# Altium schematic sheet main_2023-11-12.schdoc
size 419 x 296 mm
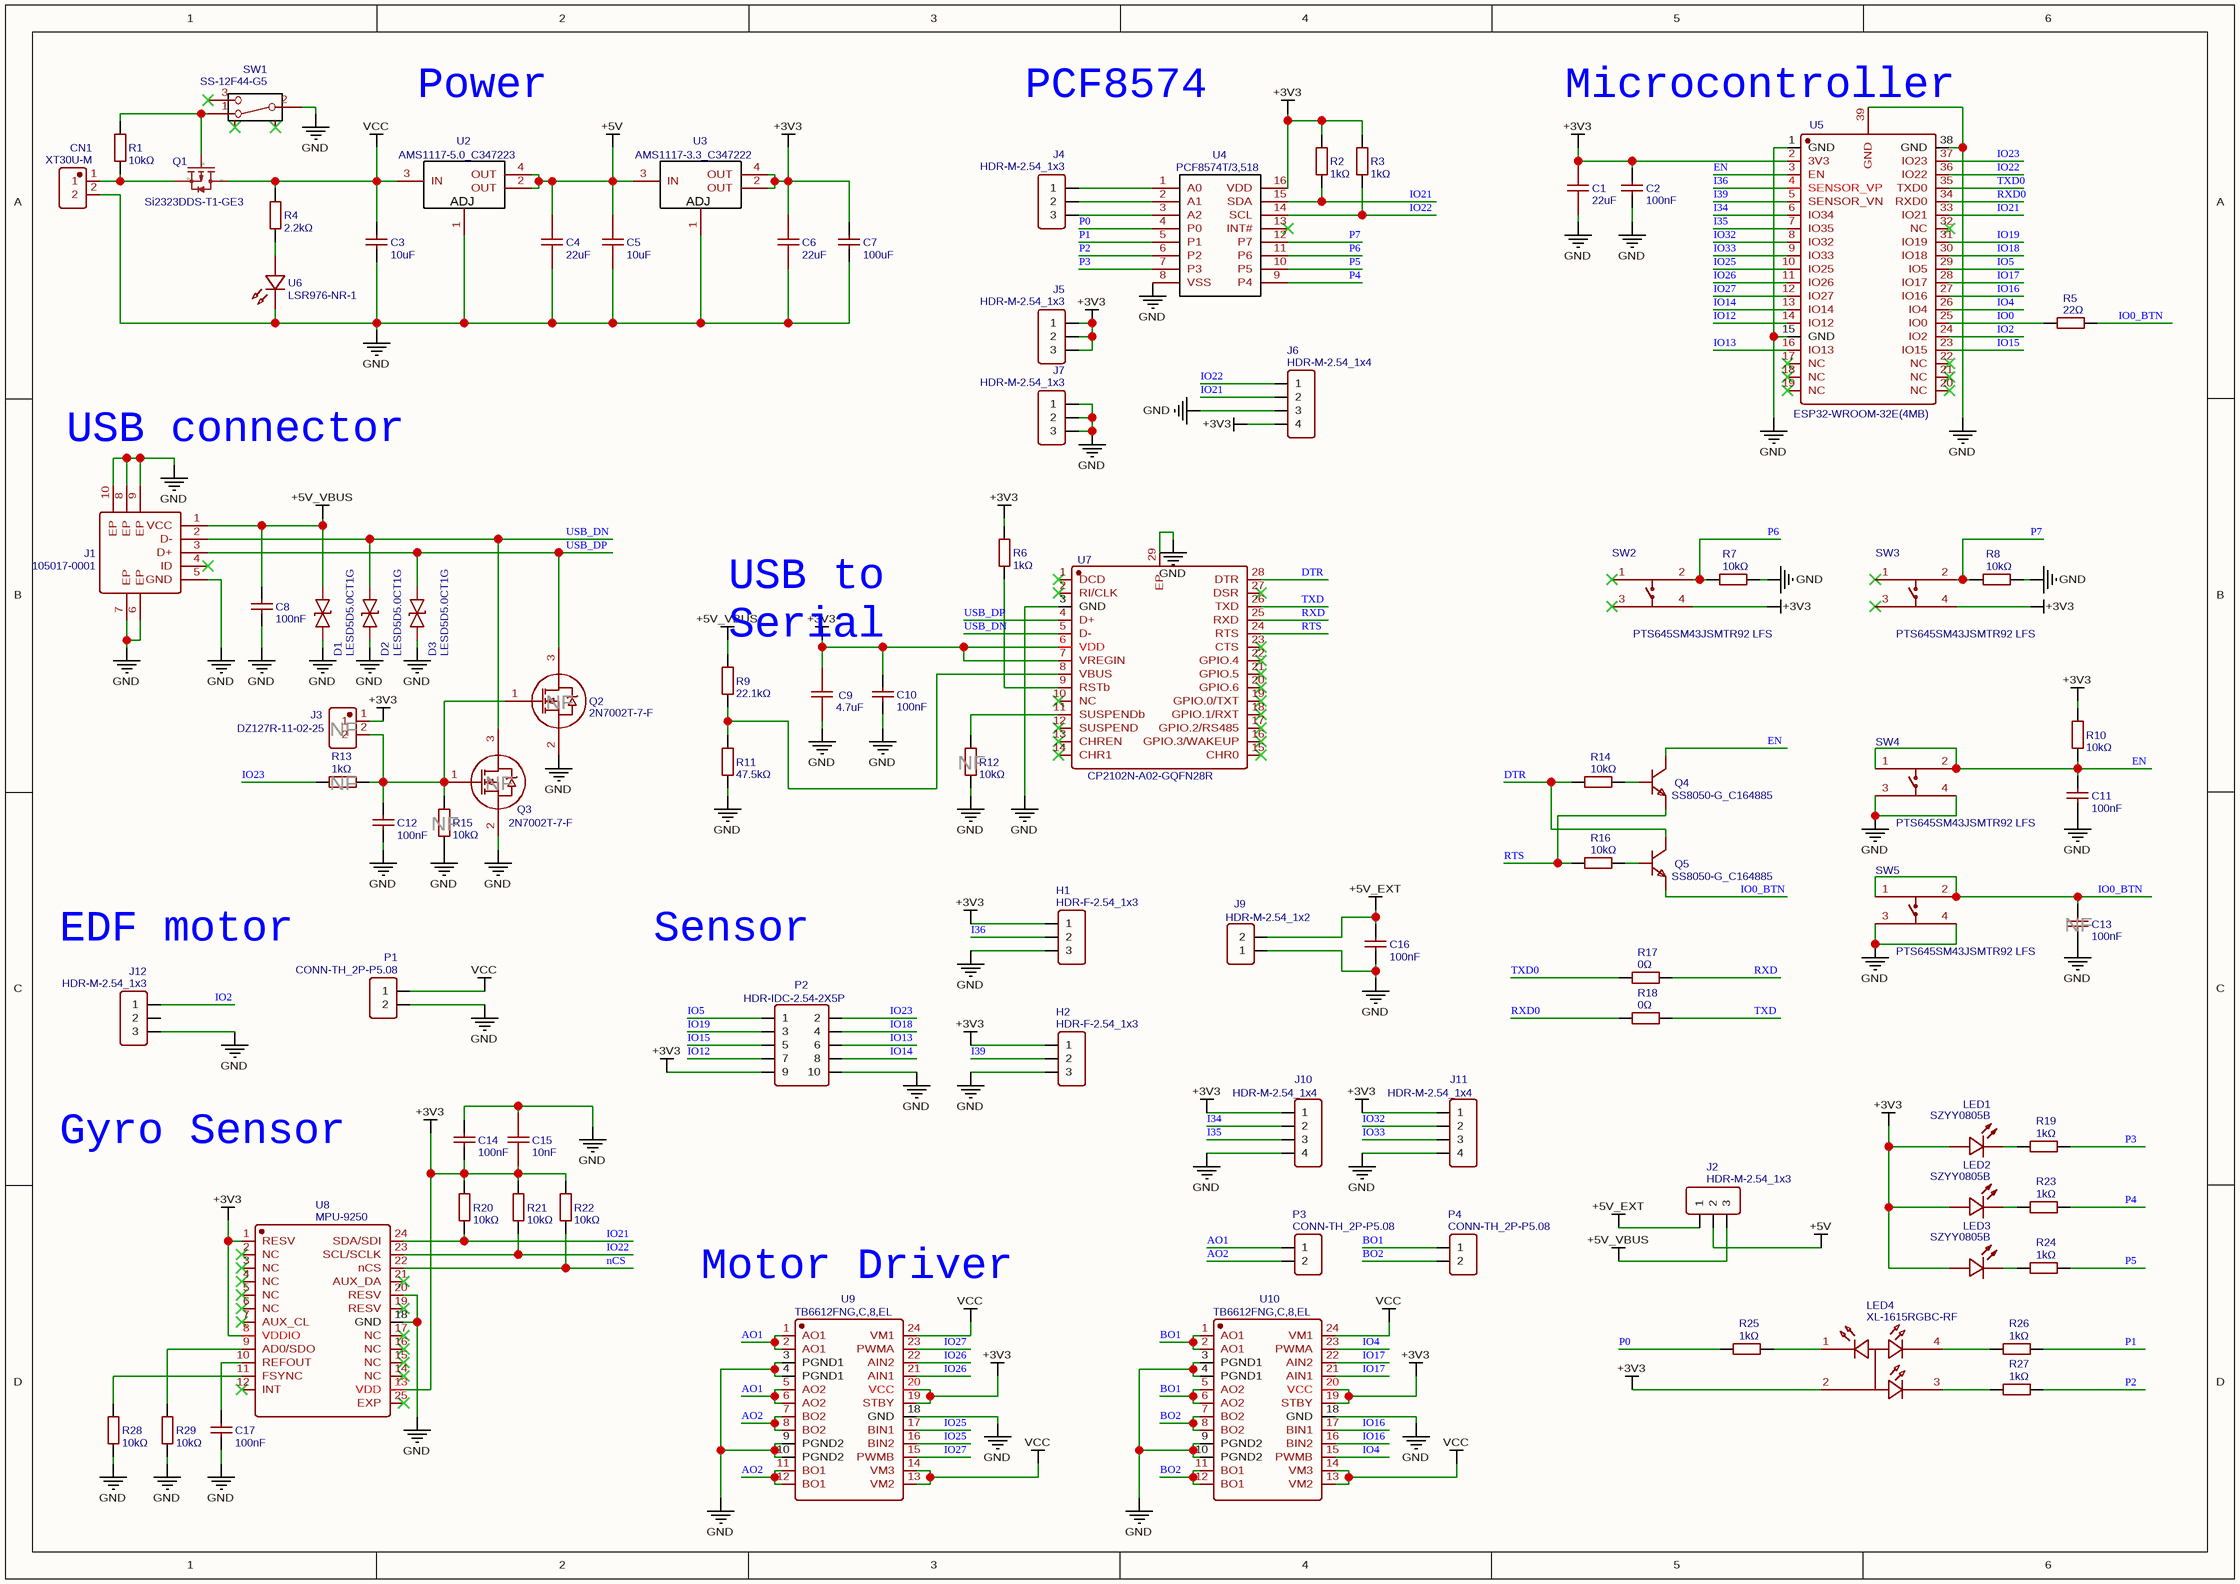
[diagram p0: main_2023-11-12.schdoc]

## Parts
C1  22uF  [C0805]
C2  100nF  [C0402]
C3  10uF  [C0805]
C4  22uF  [C0805]
C5  10uF  [C0402]
C6  22uF  [C0805]
C7  100uF  [C1206]
C8  100nF  [C0402]
C9  4.7uF  [C0402]
C10  100nF  [C0402]
C11  100nF  [C0402]
C12  100nF  [C0402]
C13  100nF  [C0402]
C14  100nF  [C0402]
C15  10nF  [C0402]
C16  100nF  [C0402]
C17  100nF  [C0402]
CN1  XT30U-M  [CONN-TH_XT30U-M]
D1  LESD5D5.0CT1G  [SOD-523_L1.2-W0.8-LS1.6-BI]
D2  LESD5D5.0CT1G  [SOD-523_L1.2-W0.8-LS1.6-BI]
D3  LESD5D5.0CT1G  [SOD-523_L1.2-W0.8-LS1.6-BI]
H1  HDR-F-2.54_1x3  [HDR-F-2.54_1X3]
H2  HDR-F-2.54_1x3  [HDR-F-2.54_1X3]
J1  105017-0001  [MICRO-USB-SMD_105017-0001]
J2  HDR-M-2.54_1x3  [HDR-M-2.54_1X3]
J3  DZ127R-11-02-25  [HDR-TH_2P-P1.27-V-M]
J4  HDR-M-2.54_1x3  [HDR-M-2.54_1X3]
J5  HDR-M-2.54_1x3  [HDR-M-2.54_1X3]
J6  HDR-M-2.54_1x4  [HDR-M-2.54_1X4]
J7  HDR-M-2.54_1x3  [HDR-M-2.54_1X3]
J9  HDR-M-2.54_1x2  [HDR-M-2.54_1X2]
J10  HDR-M-2.54_1x4  [HDR-M-2.54_1X4]
J11  HDR-M-2.54_1x4  [HDR-M-2.54_1X4]
J12  HDR-M-2.54_1x3  [HDR-M-2.54_1X3]
LED1  SZYY0805B  [LED0805-R-RD_BLUE]
LED2  SZYY0805B  [LED0805-R-RD_BLUE]
LED3  SZYY0805B  [LED0805-R-RD_BLUE]
LED4  XL-1615RGBC-RF  [LED-ARRAY-SMD_4P-L1.6-W1.5-BR_XL-1615RGBC-RF]
P1  CONN-TH_2P-P5.08  [CONN-TH_2P-P5.08]
P2  HDR-IDC-2.54-2X5P  [IDC-TH_10P-P2.54_C5665]
P3  CONN-TH_2P-P5.08  [CONN-TH_2P-P5.08]
P4  CONN-TH_2P-P5.08  [CONN-TH_2P-P5.08]
Q1  Si2323DDS-T1-GE3  [SOT-23-3_L2.9-W1.3-P1.90-LS2.4-BR]
Q2  2N7002T-7-F  [SOT-523-3_L1.6-W0.8-P1.00-LS1.6-BR]
Q3  2N7002T-7-F  [SOT-523-3_L1.6-W0.8-P1.00-LS1.6-BR]
Q4  SS8050-G_C164885  [SOT-23-3_L2.9-W1.3-P1.90-LS2.4-BR]
Q5  SS8050-G_C164885  [SOT-23-3_L2.9-W1.3-P1.90-LS2.4-BR]
R1  10kΩ  [R0805]
R2  1kΩ  [R0402]
R3  1kΩ  [R0402]
R4  2.2kΩ  [R0603]
R5  22Ω  [R0402]
R6  1kΩ  [R0402]
R7  10kΩ  [R0402]
R8  10kΩ  [R0402]
R9  22.1kΩ  [R0402]
R10  10kΩ  [R0402]
R11  47.5kΩ  [R0402]
R12  10kΩ  [R0402]
R13  1kΩ  [R0402]
R14  10kΩ  [R0402]
R15  10kΩ  [R0402]
R16  10kΩ  [R0402]
R17  0Ω  [R0402]
R18  0Ω  [R0402]
R19  1kΩ  [R0402]
R20  10kΩ  [R0402]
R21  10kΩ  [R0402]
R22  10kΩ  [R0402]
R23  1kΩ  [R0402]
R24  1kΩ  [R0402]
R25  1kΩ  [R0402]
R26  1kΩ  [R0402]
R27  1kΩ  [R0402]
R28  10kΩ  [R0402]
R29  10kΩ  [R0402]
SW1  SS-12F44-G5  [SW-TH_SS-12F44-G5]
SW2  PTS645SM43JSMTR92 LFS  [KEY-SMD_4P-L6.0-W6.0-P4.50-LS6.6]
SW3  PTS645SM43JSMTR92 LFS  [KEY-SMD_4P-L6.0-W6.0-P4.50-LS6.6]
SW4  PTS645SM43JSMTR92 LFS  [KEY-SMD_4P-L6.0-W6.0-P4.50-LS6.6]
SW5  PTS645SM43JSMTR92 LFS  [KEY-SMD_4P-L6.0-W6.0-P4.50-LS6.6]
U2  AMS1117-5.0_C347223  [SOT-223_L6.7-W3.5-P2.30-BR]
U3  AMS1117-3.3_C347222  [SOT-223_L6.7-W3.5-P2.30-BR]
U4  PCF8574T/3,518  [SOIC-16_L10.3-W7.5-P1.27-LS10.3-BL]
U5  ESP32-WROOM-32E(4MB)  [WIFI-SMD_ESP32-WROOM-32E]
U6  LSR976-NR-1  [LED0805-RD_RED]
U7  CP2102N-A02-GQFN28R  [QFN-28_L5.0-W5.0-P0.50-TL-EP3.3]
U8  MPU-9250  [QFN-24_L3.0-W3.0-P0.40-BL-EP]
U9  TB6612FNG,C,8,EL  [SSOP-24_L8.3-W5.6-P0.65-LS7.6-BL]
U10  TB6612FNG,C,8,EL  [SSOP-24_L8.3-W5.6-P0.65-LS7.6-BL]

## Nets
+3V3: C1.1 C2.1 C6.1 C7.1 C9.2 C10.1 C14.1 C15.1 H1.1 H2.1 J3.1 J5.1 J5.2 J5.3 J6.4 J10.1 J11.1 LED1.1(+) LED2.1(+) LED3.1(+) LED4.2(COM+) P2.9 R2.1 R3.1 R6.1 R10.1 R20.1 R21.1 R22.1 SW2.4 SW3.4 U3.2(OUT) U3.4(OUT) U4.16(VDD) U5.2(3V3) U7.6(VDD) U7.7(VREGIN) U8.1(RESV) U8.8(VDDIO) U8.13(VDD) U9.19(STBY) U9.20(VCC) U10.19(STBY) U10.20(VCC)
+5V: C4.1 C5.1 J2.2 U2.2(OUT) U2.4(OUT) U3.3(IN)
+5V_EXT: C16.2 J2.1 J9.2
+5V_VBUS: C8.1 D1.1 J1.1(VCC) J2.3 R9.1
GND: C1.2 C2.2 C3.2 C4.2 C5.2 C6.2 C7.2 C8.2 C9.1 C10.2 C11.2 C12.2 C13.2 C14.2 C15.2 C16.1 C17.2 CN1.2 D1.2 D2.2 D3.2 H1.3 H2.3 J1.5(GND) J1.6(EP) J1.7(EP) J1.8(EP) J1.9(EP) J1.10(EP) J6.3 J7.1 J7.2 J7.3 J9.1 J10.4 J11.4 J12.3 P1.2 P2.10 Q2.2(S) Q3.2(S) R7.2 R8.2 R11.2 R12.2 R15.2 R28.2 R29.2 SW1.2 SW4.3 SW4.4 SW5.3 SW5.4 U2.1(ADJ) U3.1(ADJ) U4.8(VSS) U5.1(GND) U5.15(GND) U5.38(GND) U5.39(GND) U6.1(K) U7.3(GND) U7.29(EP) U8.18(GND) U8.20(RESV) U9.3(PGND1) U9.4(PGND1) U9.9(PGND2) U9.10(PGND2) U9.18(GND) U10.3(PGND1) U10.4(PGND1) U10.9(PGND2) U10.10(PGND2) U10.18(GND)
VCC: C3.1 P1.1 Q1.3(D) R4.1 U2.3(IN) U9.13(VM2) U9.14(VM3) U9.24(VM1) U10.13(VM2) U10.14(VM3) U10.24(VM1)
AO1: P3.1 U9.1(AO1) U9.2(AO1) U9.5(AO2) U9.6(AO2)
AO2: P3.2 U9.7(BO2) U9.8(BO2) U9.11(BO1) U9.12(BO1)
BO1: P4.1 U10.1(AO1) U10.2(AO1) U10.5(AO2) U10.6(AO2)
BO2: P4.2 U10.7(BO2) U10.8(BO2) U10.11(BO1) U10.12(BO1)
DTR: Q5.3(C) R14.1 U7.28(DTR)
EN: C11.1 Q4.3(C) R10.2 SW4.1 SW4.2 U5.3(EN)
I34: J10.2 U5.6(IO34)
I35: J10.3 U5.7(IO35)
I36: H1.2 U5.4(SENSOR_VP)
I39: H2.2 U5.5(SENSOR_VN)
IO0: R5.1 U5.25(IO0)
IO0_BTN: C13.1 Q5.2(E) R5.2 SW5.1 SW5.2
IO2: J12.1 U5.24(IO2)
IO4: U5.26(IO4) U10.15(PWMB) U10.23(PWMA)
IO5: P2.1 U5.29(IO5)
IO12: P2.7 U5.14(IO12)
IO13: P2.6 U5.16(IO13)
IO14: P2.8 U5.13(IO14)
IO15: P2.5 U5.23(IO15)
IO16: U5.27(IO16) U10.16(BIN2) U10.17(BIN1)
IO17: U5.28(IO17) U10.21(AIN1) U10.22(AIN2)
IO18: P2.4 U5.30(IO18)
IO19: P2.3 U5.31(IO19)
IO21: J6.2 R2.2 R20.2 U4.15(SDA) U5.33(IO21) U8.24(SDA/SDI)
IO22: J6.1 R3.2 R21.2 U4.14(SCL) U5.36(IO22) U8.23(SCL/SCLK)
IO23: P2.2 R13.1 U5.37(IO23)
IO25: U5.10(IO25) U9.16(BIN2) U9.17(BIN1)
IO26: U5.11(IO26) U9.21(AIN1) U9.22(AIN2)
IO27: U5.12(IO27) U9.15(PWMB) U9.23(PWMA)
IO32: J11.2 U5.8(IO32)
IO33: J11.3 U5.9(IO33)
nCS: R22.2 U8.22(nCS)
P0: R25.1 U4.4(P0)
P1: R26.2 U4.5(P1)
P2: R27.2 U4.6(P2)
P3: R19.2 U4.7(P3)
P4: R23.2 U4.9(P4)
P5: R24.2 U4.10(P5)
P6: R7.1 SW2.2 U4.11(P6)
P7: R8.1 SW3.2 U4.12(P7)
RTS: Q4.2(E) R16.1 U7.24(RTS)
RXD: R17.2 U7.25(RXD)
RXD0: R18.1 U5.34(RXD0)
TXD: R18.2 U7.26(TXD)
TXD0: R17.1 U5.35(TXD0)
USB_DN: D2.1 J1.2(D-) Q3.3(D) U7.5(D-)
USB_DP: D3.1 J1.3(D+) Q2.3(D) U7.4(D+)
NetC12_1: C12.1 J3.2 Q2.1(G) Q3.1(G) R13.2 R15.1
NetC17_1: C17.1 U8.10(REFOUT)
NetCN1_1: CN1.1 Q1.2(S) R1.2
NetJ4_1: J4.1 U4.1(A0)
NetJ4_2: J4.2 U4.2(A1)
NetJ4_3: J4.3 U4.3(A2)
NetLED1_2: LED1.2(-) R19.1
NetLED2_2: LED2.2(-) R23.1
NetLED3_2: LED3.2(-) R24.1
NetLED4_1: LED4.1(R-) R25.2
NetLED4_3: LED4.3(B-) R27.1
NetLED4_4: LED4.4(G-) R26.1
NetQ1_1: Q1.1(G) R1.1 SW1.1
NetQ4_1: Q4.1(B) R14.2
NetQ5_1: Q5.1(B) R16.2
NetR4_2: R4.2 U6.2(A)
NetR6_2: R6.2 U7.9(RSTb)
NetR9_2: R9.2 R11.1 U7.8(VBUS)
NetR12_1: R12.1 U7.11(SUSPENDb)
NetR28_1: R28.1 U8.11(FSYNC)
NetR29_1: R29.1 U8.9(AD0/SDO)

Not connected (* = marked no-connect by the designer): J1 4(ID)*; J12 2; SW1 3* 4* 5*; SW2 1* 3*; SW3 1* 3*; U4 13(INT#)*; U5 17(NC)* 18(NC)* 19(NC)* 20(NC)* 21(NC)* 22(NC)* 32(NC)*; U7 1(DCD)* 2(RI/CLK)* 10(NC)* 12(SUSPEND)* 13(CHREN)* 14(CHR1)* 15(CHR0)* 16(GPIO.3/WAKEUP)* 17(GPIO.2/RS485)* 18(GPIO.1/RXT)* 19(GPIO.0/TXT)* 20(GPIO.6)* 21(GPIO.5)* 22(GPIO.4)* 23(CTS)* 27(DSR)*; U8 2(NC)* 3(NC)* 4(NC)* 5(NC)* 6(NC)* 7(AUX_CL)* 12(INT)* 14(NC)* 15(NC)* 16(NC)* 17(NC)* 19(RESV)* 21(AUX_DA)* 25(EXP)*

## Notes on the sheet
- Power
- PCF8574
- (near U5) Microcontroller
- USB connector
- USB to
  Serial
- (near Q2) NF
- (near R13) NF
- (near J3) NF
- (near Q3) NF
- (near R12) NF
- (near R15) NF
- (near C13) NF
- (near J12) EDF motor
- Sensor
- Gyro Sensor
- (near U9) Motor Driver

## Library data of the parts
C1 = 22uF: Manufacturer: SAMSUNG(三星); Manufacturer Part: CL21A226MAYNNNE; nameAlias: Value; Contributor: LCSC; Supplier: LCSC; Supplier Part: C602037; JLCPCB Part Class: Extended Part; link: https://lcsc.com/eda_search?q=C602037&%26type=1&ref=editor; spicePre: C; spiceSymbolName: CL21A226MAYNNNE
C2 C8 C10-C14 C16 C17 = 100nF: Manufacturer Part: CL05B104KO5NNNC; Manufacturer: SAMSUNG(三星); nameAlias: Value; Supplier: LCSC; Supplier Part: C1525; JLCPCB Part Class: Basic Part; link: https://lcsc.com/eda_search?q=C1525&%26type=1&ref=editor; spicePre: C; spiceSymbolName: CL05B104KO5NNNC
C3 = 10uF: Manufacturer Part: CL21A106KOQNNNE; Manufacturer: SAMSUNG(三星); nameAlias: Value; Supplier: LCSC; Supplier Part: C1713; JLCPCB Part Class: Extended Part; link: https://lcsc.com/eda_search?q=C1713&%26type=1&ref=editor; spicePre: C; spiceSymbolName: CL21A106KOQNNNE
C4 C6 = 22uF: Manufacturer: SAMSUNG(三星); Manufacturer Part: CL21A226MAQNNNE; nameAlias: Value; Supplier: LCSC; Supplier Part: C45783; JLCPCB Part Class: Basic Part; link: https://lcsc.com/eda_search?q=C45783&%26type=1&ref=editor; spicePre: C; spiceSymbolName: CL21A226MAQNNNE
C5 = 10uF: Manufacturer: SAMSUNG(三星); Manufacturer Part: CL05A106MP5NUNC; nameAlias: Value; Contributor: LCSC; Supplier: LCSC; Supplier Part: C315248; JLCPCB Part Class: Extended Part; link: https://lcsc.com/eda_search?q=C315248&%26type=1&ref=editor; spicePre: C; spiceSymbolName: CL05A106MP5NUNC_C315248
C7 = 100uF: Manufacturer Part: CL31A107MQHNNNE; Manufacturer: SAMSUNG(三星); nameAlias: Value; Supplier: LCSC; Supplier Part: C15008; JLCPCB Part Class: Basic Part; link: https://lcsc.com/eda_search?q=C15008&%26type=1&ref=editor; spicePre: C; spiceSymbolName: CL31A107MQHNNNE
C9 = 4.7uF: Manufacturer: SAMSUNG(三星); Manufacturer Part: CL05A475KP5NRNC; nameAlias: Value; Contributor: LCSC; Supplier: LCSC; Supplier Part: C368809; JLCPCB Part Class: Extended Part; link: https://lcsc.com/eda_search?q=C368809&%26type=1&ref=editor; spicePre: C; spiceSymbolName: CL05A475KP5NRNC
C15 = 10nF: Manufacturer: SAMSUNG(三星); Manufacturer Part: CL05B103JO5NNNC; nameAlias: Value; Contributor: LCSC; Supplier: LCSC; Supplier Part: C400948; JLCPCB Part Class: Extended Part; link: https://lcsc.com/eda_search?q=C400948&%26type=1&ref=editor; spicePre: C; spiceSymbolName: CL05B103JO5NNNC
CN1 = XT30U-M: Manufacturer: AMASS(艾迈斯); Contributor: lcsc; Supplier: LCSC; Supplier Part: C99101; Manufacturer Part: XT30U-M; JLCPCB Part Class: Extended Part; link: https://lcsc.com/eda_search?q=C99101&%26type=1&ref=editor; spicePre: C; spiceSymbolName: XT30U-M
D1-D3 = LESD5D5.0CT1G: Manufacturer: LRC(乐山无线电); Contributor: LCSC; Supplier: LCSC; Supplier Part: C383211; Manufacturer Part: LESD5D5.0CT1G; JLCPCB Part Class: Extended Part; link: https://lcsc.com/eda_search?q=C383211&%26type=1&ref=editor; spicePre: D; spiceSymbolName: LESD5D5.0CT1G
H1 H2 = HDR-F-2.54_1x3: Contributor: LCEDA_Lib; Supplier Part: C146690; Supplier: LCSC; spicePre: H; spiceSymbolName: HDR-F-2.54_1x3
J1 = 105017-0001: Manufacturer: MOLEX; Manufacturer Part: 1050170001; Contributor: LCSC; Supplier: LCSC; Supplier Part: C136000; JLCPCB Part Class: Extended Part; link: https://lcsc.com/eda_search?q=C136000&%26type=1&ref=editor; spicePre: U; spiceSymbolName: 105017-0001
J2 J4 J5 J7 J12 = HDR-M-2.54_1x3: Contributor: LCEDA_Lib; Supplier Part: C180248; Supplier: LCSC; spicePre: J; spiceSymbolName: HDR-M-2.54_1x3
J3 = DZ127R-11-02-25: Manufacturer: DEALON(德艺隆); Contributor: LCSC; Supplier: LCSC; Supplier Part: C2935942; Manufacturer Part: DZ127R-11-02-25; JLCPCB Part Class: Extended Part; link: https://lcsc.com/eda_search?q=C2935942&%26type=1&ref=editor; spicePre: H; spiceSymbolName: DZ127R-11-02-25
J6 J10 J11 = HDR-M-2.54_1x4: Contributor: LCEDA_Lib; Supplier Part: C124378; Supplier: LCSC; spicePre: J; spiceSymbolName: HDR-M-2.54_1x4
J9 = HDR-M-2.54_1x2: Contributor: LCEDA_Lib; Supplier Part: C124375; Supplier: LCSC; spicePre: J; spiceSymbolName: HDR-M-2.54_1x2
LED1-LED3 = SZYY0805B: Manufacturer: yongyu(永裕光电); Contributor: LCSC; Supplier: LCSC; Supplier Part: C434433; Manufacturer Part: SZYY0805B; JLCPCB Part Class: Extended Part; link: https://lcsc.com/eda_search?q=C434433&%26type=1&ref=editor; spicePre: L; spiceSymbolName: SZYY0805B
LED4 = XL-1615RGBC-RF: Manufacturer: XINGLIGHT(成兴光); Contributor: LCSC; Supplier: LCSC; Supplier Part: C965840; Manufacturer Part: XL-1615RGBC-RF; JLCPCB Part Class: Extended Part; link: https://lcsc.com/eda_search?q=C965840&%26type=1&ref=editor; spicePre: L; spiceSymbolName: XL-1615RGBC-RF
P1 P3 P4 = CONN-TH_2P-P5.08: Contributor: LCEDA_Lib; Supplier: LCSC; spicePre: P; spiceSymbolName: CONN-TH_2P-P5.08
P2 = HDR-IDC-2.54-2X5P: Manufacturer: BOOMELE; Manufacturer Part: IDC Box 2.54mm 2X5P; Supplier: LCSC; image: //image.lceda.cn/szlcsc/C5665.jpg; Supplier Part: C5665; spicePre: P; spiceSymbolName: HDR-IDC-2.54-2X5P
Q1 = Si2323DDS-T1-GE3: Manufacturer: VISHAY(威世); Contributor: LCSC; Supplier: LCSC; Manufacturer Part: Si2323DDS-T1-GE3; Supplier Part: C165449; JLCPCB Part Class: Extended Part; link: https://lcsc.com/eda_search?q=C165449&%26type=1&ref=editor; spicePre: Q; spiceSymbolName: Si2323DDS-T1-GE3
Q2 Q3 = 2N7002T-7-F: Manufacturer: DIODES(美台); Contributor: LCSC; Supplier: LCSC; Manufacturer Part: 2N7002T-7-F; Supplier Part: C139445; JLCPCB Part Class: Extended Part; link: https://lcsc.com/eda_search?q=C139445&%26type=1&ref=editor; spicePre: Q; spiceSymbolName: 2N7002T-7-F
Q4 Q5 = SS8050-G_C164885: Manufacturer: CJ(江苏长电/长晶); Contributor: LCSC; Supplier: LCSC; Supplier Part: C164885; Manufacturer Part: SS8050-G; JLCPCB Part Class: Extended Part; link: https://lcsc.com/eda_search?q=C164885&%26type=1&ref=editor; spicePre: Q; spiceSymbolName: SS8050-G_C164885
R1 = 10kΩ: Manufacturer: UNI-ROYAL(厚声); Manufacturer Part: 0805W8F1002T5E; nameAlias: Value; Supplier: LCSC; Supplier Part: C17414; JLCPCB Part Class: Basic Part; link: https://lcsc.com/eda_search?q=C17414&%26type=1&ref=editor; spicePre: R; spiceSymbolName: 0805W8F1002T5E
R2 R3 R6 R13 R19 R23-R27 = 1kΩ: Manufacturer: UNI-ROYAL(厚声); Manufacturer Part: 0402WGF1001TCE; nameAlias: Value; Supplier: LCSC; Supplier Part: C11702; JLCPCB Part Class: Basic Part; link: https://lcsc.com/eda_search?q=C11702&%26type=1&ref=editor; spicePre: R; spiceSymbolName: 0402WGF1001TCE
R4 = 2.2kΩ: Manufacturer: UNI-ROYAL(厚声); Manufacturer Part: 0603WAF2201T5E; nameAlias: Value; Supplier: LCSC; Supplier Part: C4190; JLCPCB Part Class: Basic Part; link: https://lcsc.com/eda_search?q=C4190&%26type=1&ref=editor; spicePre: R; spiceSymbolName: 0603WAF2201T5E
R5 = 22Ω: Manufacturer: UNI-ROYAL(厚声); Manufacturer Part: 0402WGF220JTCE; nameAlias: Value; Supplier: LCSC; Supplier Part: C25092; JLCPCB Part Class: Basic Part; link: https://lcsc.com/eda_search?q=C25092&%26type=1&ref=editor; spicePre: R; spiceSymbolName: 0402WGF220JTCE
R7 R8 R10 R12 R14-R16 R20-R22 R28 R29 = 10kΩ: Manufacturer: UNI-ROYAL(厚声); Manufacturer Part: 0402WGF1002TCE; nameAlias: Value; Supplier: LCSC; Supplier Part: C25744; JLCPCB Part Class: Basic Part; link: https://lcsc.com/eda_search?q=C25744&%26type=1&ref=editor; spicePre: R; spiceSymbolName: 0402WGF1002TCE
R9 = 22.1kΩ: Manufacturer: UNI-ROYAL(厚声); Manufacturer Part: 0402WGF2212TCE; nameAlias: Value; Supplier: LCSC; Supplier Part: C43473; JLCPCB Part Class: Extended Part; link: https://lcsc.com/eda_search?q=C43473&%26type=1&ref=editor; spicePre: R; spiceSymbolName: 0402WGF2212TCE
R11 = 47.5kΩ: Manufacturer: UNI-ROYAL(厚声); Manufacturer Part: 0402WGF4752TCE; nameAlias: Value; Supplier: LCSC; Supplier Part: C25896; JLCPCB Part Class: Extended Part; link: https://lcsc.com/eda_search?q=C25896&%26type=1&ref=editor; spicePre: R; spiceSymbolName: 0402WGF4752TCE
R17 R18 = 0Ω: Manufacturer: UNI-ROYAL(厚声); Manufacturer Part: 0402WGF0000TCE; nameAlias: Value; Supplier: LCSC; Supplier Part: C17168; JLCPCB Part Class: Basic Part; link: https://lcsc.com/eda_search?q=C17168&%26type=1&ref=editor; spicePre: R; spiceSymbolName: 0402WGF0000TCE
SW1 = SS-12F44-G5: Manufacturer: Rectangular Connectors - Contacts; Contributor: LCSC; Supplier: LCSC; Supplier Part: C136718; Manufacturer Part: SS-12F44-G5; spicePre: S; spiceSymbolName: SS-12F44-G5
SW2-SW5 = PTS645SM43JSMTR92 LFS: Manufacturer: C&K; Contributor: LCSC; Supplier: LCSC; Supplier Part: C2801847; Manufacturer Part: PTS645SM43JSMTR92 LFS; JLCPCB Part Class: Extended Part; link: https://lcsc.com/eda_search?q=C2801847&%26type=1&ref=editor; spicePre: S; spiceSymbolName: PTS645SM43JSMTR92 LFS
U2 = AMS1117-5.0_C347223: Manufacturer: UMW(广东友台半导体); Paste Type: Extended Part; Contributor: LCEDA_Lib; Supplier: LCSC; Manufacturer Part: AMS1117-5.0; Supplier Part: C347223; spicePre: U; spiceSymbolName: LM317(SOT-223)
U3 = AMS1117-3.3_C347222: Manufacturer: UMW(广东友台半导体); Paste Type: Extended Part; Contributor: LCEDA_Lib; Supplier: LCSC; Manufacturer Part: AMS1117-3.3; Supplier Part: C347222; spicePre: U; spiceSymbolName: LM317(SOT-223)
U4 = PCF8574T/3,518: Manufacturer: NXP(恩智浦); Supplier: LCSC; Manufacturer Part: PCF8574T/3,518; Supplier Part: C7605; JLCPCB Part Class: Extended Part; link: https://lcsc.com/eda_search?q=C7605&%26type=1&ref=editor; spicePre: U; spiceSymbolName: PCF8574T/3,518
U5 = ESP32-WROOM-32E(4MB): Manufacturer: ESPRESSIF(乐鑫); Manufacturer Part: ESP32-WROOM-32E-N4; Contributor: LCSC; Supplier: LCSC; Supplier Part: C701341; JLCPCB Part Class: Extended Part; link: https://lcsc.com/eda_search?q=C701341&%26type=1&ref=editor; spicePre: U; spiceSymbolName: ESP32-WROOM-32E(4MB)
U6 = LSR976-NR-1: Manufacturer: null; Contributor: lcsc; Supplier: LCSC; Supplier Part: C9900011228; Manufacturer Part: LSR976-NR-1; JLCPCB Part Class: Extended Part; link: https://lcsc.com/eda_search?q=C9900011228&%26type=1&ref=editor; spicePre: U; spiceSymbolName: LSR976-NR-1
U7 = CP2102N-A02-GQFN28R: Manufacturer: SILICON LABS(芯科); Contributor: LCSC; Supplier: LCSC; Supplier Part: C964632; Manufacturer Part: CP2102N-A02-GQFN28R; JLCPCB Part Class: Extended Part; link: https://lcsc.com/eda_search?q=C964632&%26type=1&ref=editor; spicePre: U; spiceSymbolName: CP2102N-A02-GQFN28R
U8 = MPU-9250: Manufacturer: TDK InvenSense(应美盛); Contributor: LCSC; Supplier: LCSC; Manufacturer Part: MPU-9250; Supplier Part: C71459; JLCPCB Part Class: Extended Part; link: https://lcsc.com/eda_search?q=C71459&%26type=1&ref=editor; spicePre: U; spiceSymbolName: MPU-9250
U9 U10 = TB6612FNG,C,8,EL: Manufacturer: TOSHIBA(东芝); Contributor: LCSC; Supplier: LCSC; Manufacturer Part: TB6612FNG,C,8,EL; Supplier Part: C141517; JLCPCB Part Class: Extended Part; link: https://lcsc.com/eda_search?q=C141517&%26type=1&ref=editor; spicePre: U; spiceSymbolName: TB6612FNG,C,8,EL